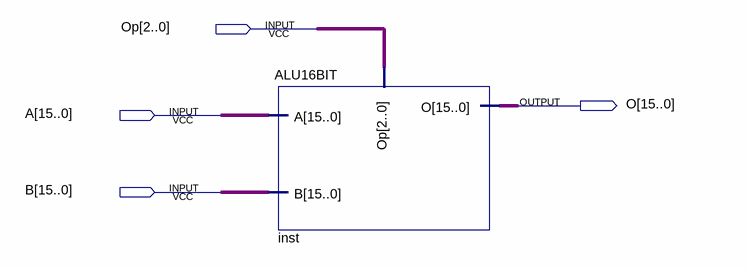
[diagram p0: schematic sheet]
// Quartus schematic ALU.bdf as structural Verilog: 1 symbols, 4 pins
module ALU (
  input  [2:0] Op,
  input  [15:0] A,
  input  [15:0] B,
  output [15:0] O
);

  ALU16BIT inst (.Op(Op), .A(A), .B(B), .O(O));
endmodule
